# Altium schematic sheet mb.SchDoc
size A4
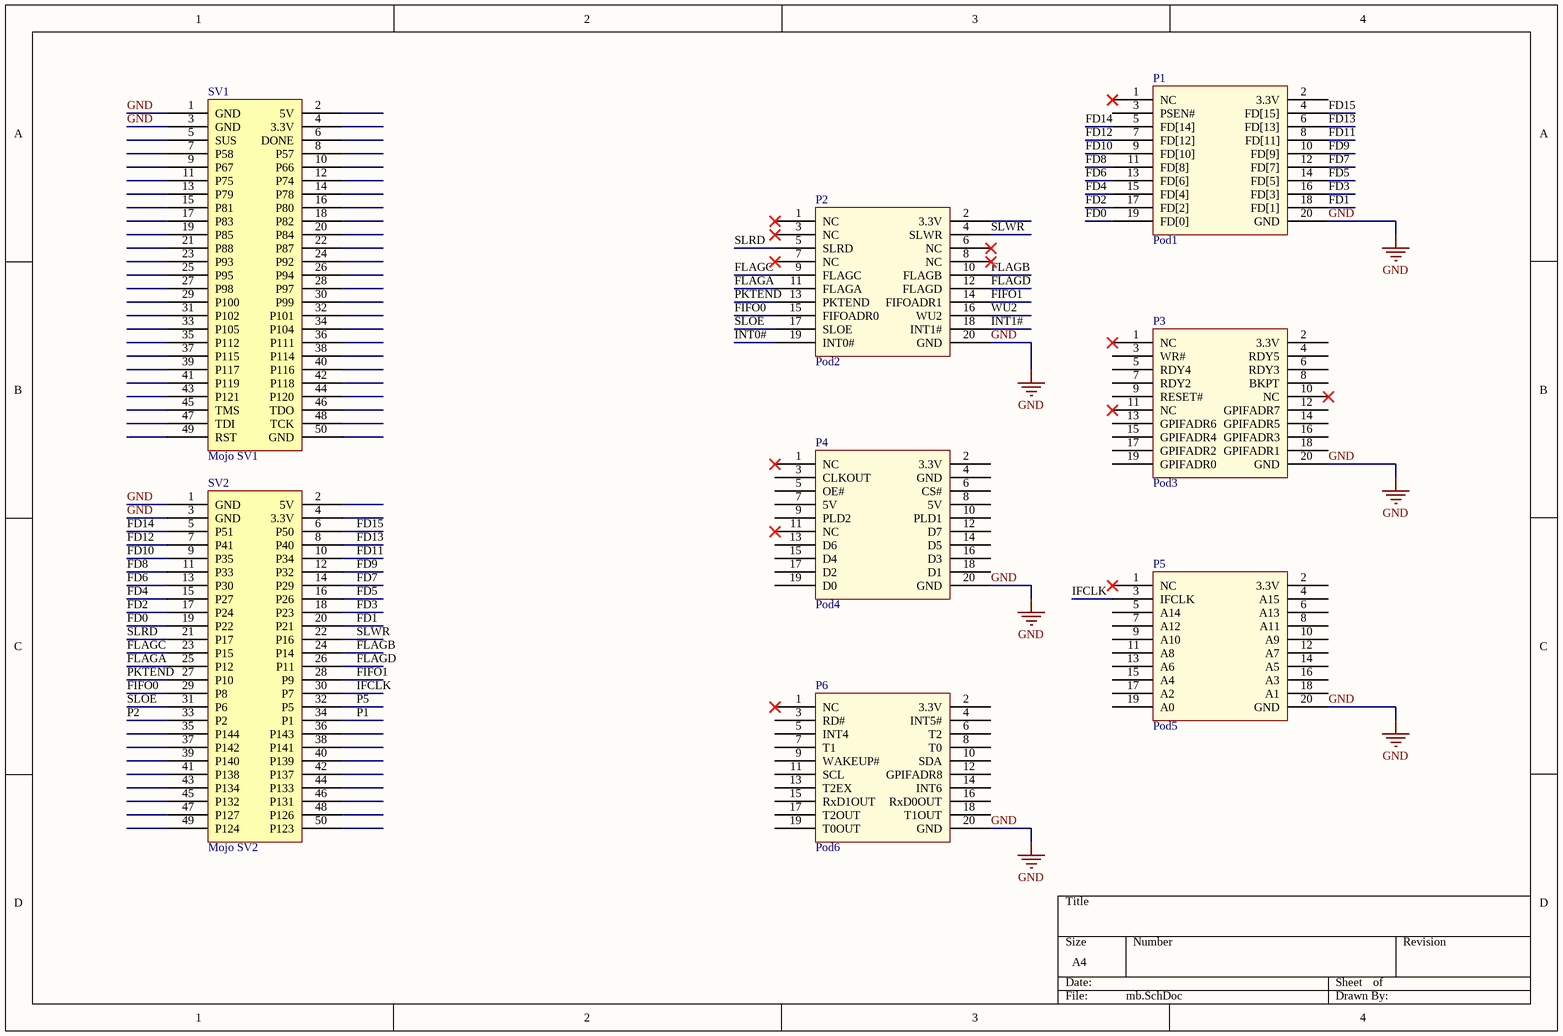
[diagram p0: mb.SchDoc]

## Parts
P1  Pod1  [Pin Header 20x2]
P2  Pod2  [Pin Header 20x2]
P3  Pod3  [Pin Header 20x2]
P4  Pod4  [Pin Header 20x2]
P5  Pod5  [Pin Header 20x2]
P6  Pod6  [Pin Header 20x2]
SV1  Mojo SV1  [PH25X2]
SV2  Mojo SV2  [PH25X2]

## Nets
GND: P1.20(GND) P2.20(GND) P3.20(GND) P4.20(GND) P5.20(GND) P6.20(GND) SV1.1(GND) SV1.3(GND) SV2.1(GND) SV2.3(GND)
FD0: P1.19(FD[0]) SV2.19(P22)
FD1: P1.18(FD[1]) SV2.20(P21)
FD2: P1.17(FD[2]) SV2.17(P24)
FD3: P1.16(FD[3]) SV2.18(P23)
FD4: P1.15(FD[4]) SV2.15(P27)
FD5: P1.14(FD[5]) SV2.16(P26)
FD6: P1.13(FD[6]) SV2.13(P30)
FD7: P1.12(FD[7]) SV2.14(P29)
FD8: P1.11(FD[8]) SV2.11(P33)
FD9: P1.10(FD[9]) SV2.12(P32)
FD10: P1.9(FD[10]) SV2.9(P35)
FD11: P1.8(FD[11]) SV2.10(P34)
FD12: P1.7(FD[12]) SV2.7(P41)
FD13: P1.6(FD[13]) SV2.8(P40)
FD14: P1.5(FD[14]) SV2.5(P51)
FD15: P1.4(FD[15]) SV2.6(P50)
FIFO0: P2.15(FIFOADR0) SV2.29(P8)
FIFO1: P2.14(FIFOADR1) SV2.28(P9)
FLAGA: P2.11(FLAGA) SV2.25(P12)
FLAGB: P2.10(FLAGB) SV2.24(P14)
FLAGC: P2.9(FLAGC) SV2.23(P15)
FLAGD: P2.12(FLAGD) SV2.26(P11)
IFCLK: P5.3(IFCLK) SV2.30(P7)
INT0#: P2.19(INT0#)
INT1#: P2.18(INT1#)
P1: SV2.34(P1)
P2: SV2.33(P2)
P5: SV2.32(P5)
PKTEND: P2.13(PKTEND) SV2.27(P10)
SLOE: P2.17(SLOE) SV2.31(P6)
SLRD: P2.5(SLRD) SV2.21(P17)
SLWR: P2.4(SLWR) SV2.22(P16)
WU2: P2.16(WU2)

Not connected (* = marked no-connect by the designer): P1 1(NC)* 2(3.3V) 3(PSEN#); P2 1(NC)* 2(3.3V) 3(NC)* 6(NC)* 7(NC)* 8(NC)*; P3 1(NC)* 2(3.3V) 3(WR#) 4(RDY5) 5(RDY4) 6(RDY3) 7(RDY2) 8(BKPT) 9(RESET#) 10(NC)* 11(NC)* 12(GPIFADR7) 13(GPIFADR6) 14(GPIFADR5) 15(GPIFADR4) 16(GPIFADR3) 17(GPIFADR2) 18(GPIFADR1) 19(GPIFADR0); P4 1(NC)* 2(3.3V) 3(CLKOUT) 4(GND) 5(OE#) 6(CS#) 7(5V) 8(5V) 9(PLD2) 10(PLD1) 11(NC)* 12(D7) 13(D6) 14(D5) 15(D4) 16(D3) 17(D2) 18(D1) 19(D0); P5 1(NC)* 2(3.3V) 4(A15) 5(A14) 6(A13) 7(A12) 8(A11) 9(A10) 10(A9) 11(A8) 12(A7) 13(A6) 14(A5) 15(A4) 16(A3) 17(A2) 18(A1) 19(A0); P6 1(NC)* 2(3.3V) 3(RD#) 4(INT5#) 5(INT4) 6(T2) 7(T1) 8(T0) 9(WAKEUP#) 10(SDA) 11(SCL) 12(GPIFADR8) 13(T2EX) 14(INT6) 15(RxD1OUT) 16(RxD0OUT) 17(T2OUT) 18(T1OUT) 19(T0OUT); SV1 2(5V) 4(3.3V) 5(SUS) 6(DONE) 7(P58) 8(P57) 9(P67) 10(P66) 11(P75) 12(P74) 13(P79) 14(P78) 15(P81) 16(P80) 17(P83) 18(P82) 19(P85) 20(P84) 21(P88) 22(P87) 23(P93) 24(P92) 25(P95) 26(P94) 27(P98) 28(P97) 29(P100) 30(P99) 31(P102) 32(P101) 33(P105) 34(P104) 35(P112) 36(P111) 37(P115) 38(P114) 39(P117) 40(P116) 41(P119) 42(P118) 43(P121) 44(P120) 45(TMS) 46(TDO) 47(TDI) 48(TCK) 49(RST) 50(GND); SV2 2(5V) 4(3.3V) 35(P144) 36(P143) 37(P142) 38(P141) 39(P140) 40(P139) 41(P138) 42(P137) 43(P134) 44(P133) 45(P132) 46(P131) 47(P127) 48(P126) 49(P124) 50(P123)

## Library data of the parts
P1 = P*
SV1 = SV1
SV2 = SV2